# EasyEDA schematic easyeda-standard-schematic.json
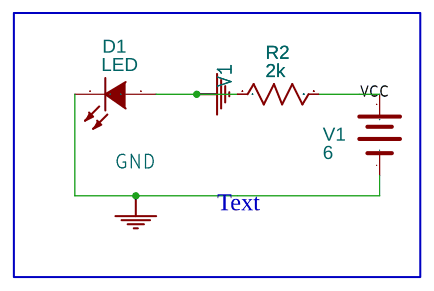
[diagram p0: schematic sheet]

## Parts
D1  LED  [LED3MM]
R2  2k  [R3]
V1  6  [BATTERY]

## Library data of the parts
D1 = LED
R2 = Resistor: Value(Ω): 1k
V1 = Battery

## Nets
GND: D1.K V1.-
V1: D1.A R2.1
VCC: R2.2 V1.+

## Notes on the sheet
- Text
